# EAGLE schematic ctrl_board (EAGLE 7.6.0)
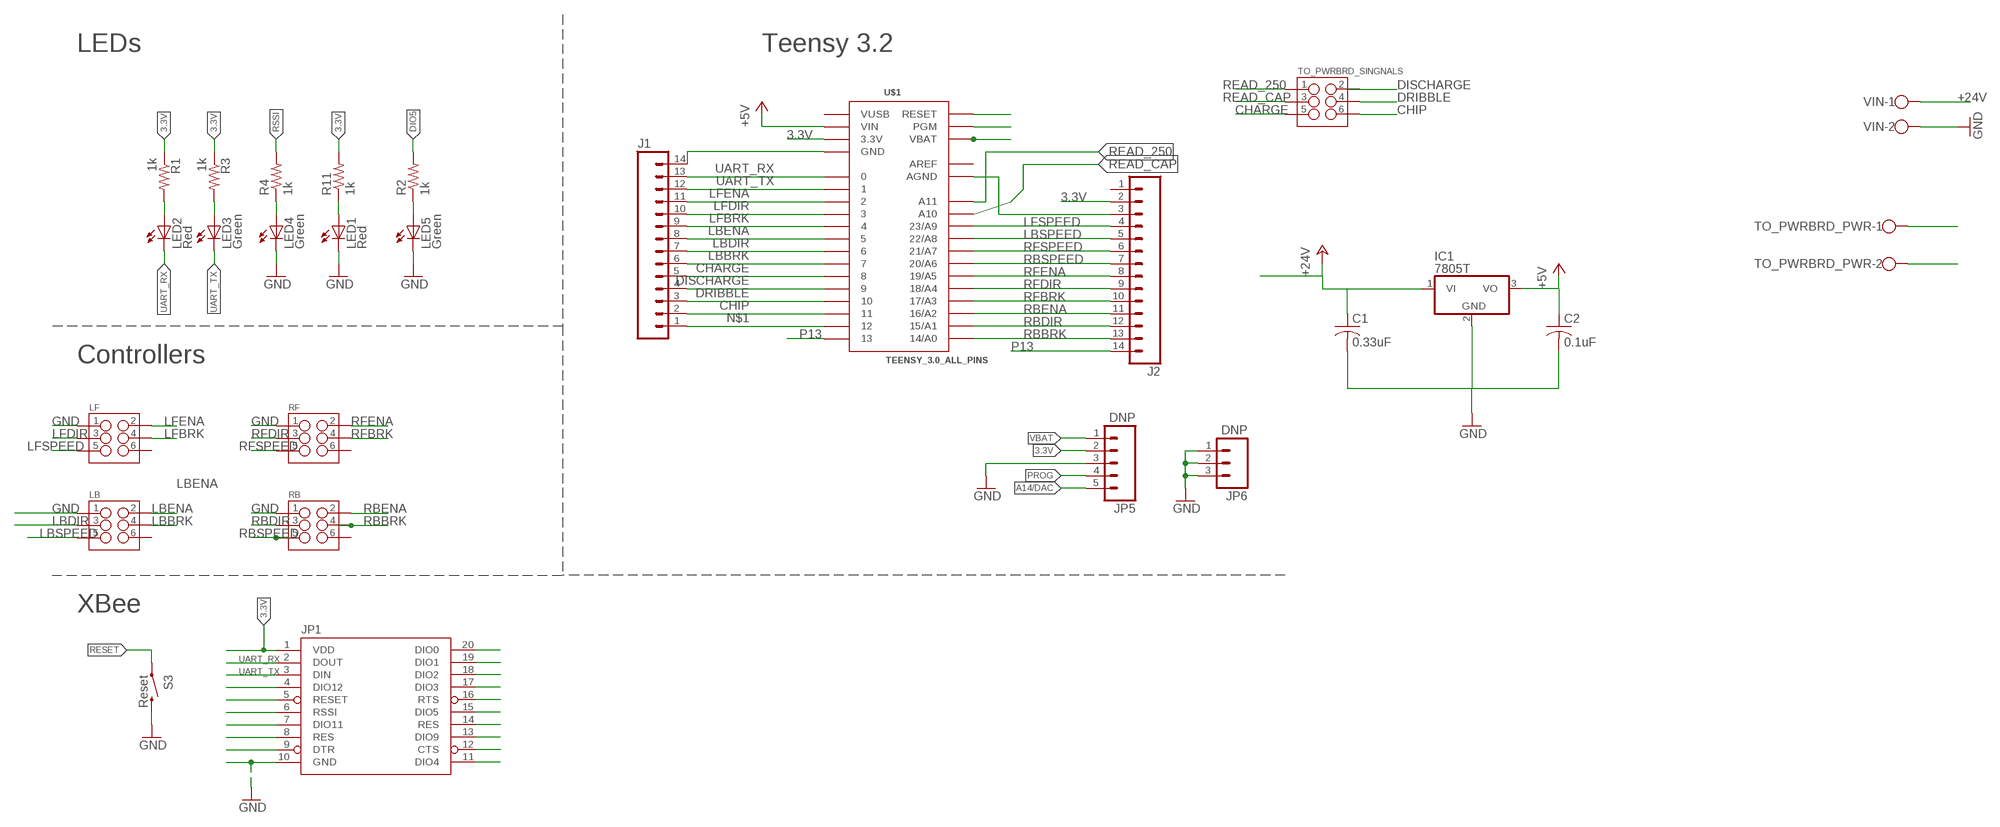
[diagram p0: schematic, sheet 1]

## Parts
C1  0.33uF  C-USC0805  [C0805]
C2  0.1uF  C-USC0805  [C0805]
IC1  7805T  [TO220H]
J1  M14  [1X14]
J2  M14  [1X14]
JP1  XBEE-1B1  [XBEE-1]
JP5  DNP  M05PTH  [1X05]
JP6  DNP  M03PTH  [1X03]
LB  M03X2POGO_PINS  [2X3_POGO]
LED1  Red  LED-RED0603  [LED-0603]
LED2  Red  LED-RED0603  [LED-0603]
LED3  Green  LED-GREEN0603  [LED-0603]
LED4  Green  LED-GREEN0603  [LED-0603]
LED5  Green  LED-GREEN0603  [LED-0603]
LF  M03X2POGO_PINS  [2X3_POGO]
R1  1k  1KOHM1/10W1%(0603)  [0603-RES]
R2  1k  1KOHM1/10W1%(0603)  [0603-RES]
R3  1k  1KOHM1/10W1%(0603)  [0603-RES]
R4  1k  1KOHM1/10W1%(0603)  [0603-RES]
R11  1k  1KOHM1/10W1%(0603)  [0603-RES]
RB  M03X2POGO_PINS  [2X3_POGO]
RF  M03X2POGO_PINS  [2X3_POGO]
S3  Reset  SWITCH-MOMENTARY-2SMD  [TACTILE-SWITCH-SMD]
TO_PWRBRD_PWR  W237-102  [W237-102]
TO_PWRBRD_SINGNALS  M03X2POGO_PINS  [2X3_POGO]
U$1  TEENSY_3.0_ALL_PINS  [TEENSY3-ALL_PINS]
VIN  W237-102  [W237-102]

## Nets
3.3V: J2.2 JP1.1(VDD) JP5.2 R1.1 R3.1 R11.2 U$1.3.3V U$1.3.3V1(3.3V)
+5V: C2.1 IC1.3(VO) U$1.VIN
+24V: C1.1 IC1.1(VI) TO_PWRBRD_PWR.1 VIN.1
A14/DAC: JP5.5 U$1.RESET/DAC(RESET)
CHARGE: J1.5 TO_PWRBRD_SINGNALS.P$5 U$1.8
CHIP: J1.2 TO_PWRBRD_SINGNALS.P$6 U$1.11
CTS: JP1.12(CTS)
DIO0: JP1.20(DIO0)
DIO1: JP1.19(DIO1)
DIO2: JP1.18(DIO2)
DIO3: JP1.17(DIO3)
DIO4: JP1.11(DIO4)
DIO5: JP1.15(DIO5) R2.2
DIO9: JP1.13(DIO9)
DIO11: JP1.7(DIO11)
DIO12: JP1.4(DIO12)
DISCHARGE: J1.4 U$1.9
DRIBBLE: J1.3 TO_PWRBRD_SINGNALS.P$4 U$1.10
DTR: JP1.9(DTR)
GND: C1.2 C2.2 IC1.2(GND) J1.14 JP1.10(GND) JP5.3 JP6.1 JP6.2 JP6.3 LB.P$1 LED1.C LED4.C LED5.C LF.P$1 RB.P$1 RF.P$1 S3.3 TO_PWRBRD_PWR.2 U$1.GND U$1.GND1(GND) VIN.2
LBBRK: J1.6 LB.P$4 U$1.7
LBDIR: J1.7 LB.P$3 U$1.6
LBENA: J1.8 LB.P$2 U$1.5
LBSPEED: J2.5 LB.P$5 U$1.22/A8
LFBRK: J1.9 LF.P$4 U$1.4
LFDIR: J1.10 LF.P$3 U$1.3
LFENA: J1.11 LF.P$2 U$1.2
LFSPEED: J2.4 LF.P$5 U$1.23/A9
N$1: J1.1 U$1.12
N$12: LED1.A R11.1
N$17: LED2.A R1.2
N$18: J2.3 U$1.AGND
N$19: LED3.A R3.2
N$43: LED4.A R4.1
N$139: LED5.A R2.1
P13: J2.14 U$1.13
PROG: JP5.4 U$1.PGM
RBBRK: J2.13 RB.P$4 U$1.14/A0
RBDIR: J2.12 RB.P$3 U$1.15/A1
RBENA: J2.11 RB.P$2 U$1.16/A2
RBSPEED: J2.7 RB.P$5 U$1.20/A6
READ_250: TO_PWRBRD_SINGNALS.P$1 U$1.A11
READ_CAP: TO_PWRBRD_SINGNALS.P$3 U$1.A10
RES: JP1.8(RES)
RES2: JP1.14(RES)
RESET: JP1.5(RESET) S3.1
RFBRK: J2.10 RF.P$4 U$1.17/A3
RFDIR: J2.9 RF.P$3 U$1.18/A4
RFENA: J2.8 RF.P$2 U$1.19/A5
RFSPEED: J2.6 RF.P$5 U$1.21/A7
RSSI: JP1.6(RSSI) R4.2
RTS: JP1.16(RTS)
UART_RX: J1.13 JP1.2(DOUT) LED2.C U$1.0
UART_TX: J1.12 JP1.3(DIN) LED3.C U$1.1
VBAT: JP5.1 U$1.VBAT
Unconnected: J2.1 LB.P$6 LF.P$6 RB.P$6 RF.P$6 TO_PWRBRD_SINGNALS.P$2

## Notes on the sheet
- LEDs | Teensy 3.2
- Controllers
- XBee

## Power pins joined to a net without a drawn wire
AREF: U$1.AREF
VUSB: U$1.VUSB

## Library data of the parts
C1 C2 = adafruit:C-US: CAPACITOR, American symbol
IC1 = linear:78*: Positive VOLTAGE REGULATOR Source: http://cache.national.com/ds/LM/LM78L05.pdf http://www.fairchildsemi.com/ds/LM/LM7805.pdf
J1 J2 = SparkFun-Connectors:M14: Header 14 Standard 14-pin 0.1" header. Use with straight break away headers (SKU : PRT-00116), right angle break away headers (PRT-00553), swiss pins (PRT-00743), machine pins (PRT-00117), and female headers (PRT-00115).
JP1 = SparkFun-RF:XBEE-1: Xbee module footprints
JP5 = SparkFun-Connectors:M05: Header 5 Standard 5-pin 0.1" header. Use with straight break away headers (SKU : PRT-00116), right angle break away headers (PRT-00553), swiss pins (PRT-00743), machine pins (PRT-00117), and female headers (PRT-00115). Molex polarized connector foot print use with SKU : PRT-08230 with associated crimp pins and housings.
JP6 = SparkFun-Connectors:M03: Header 3 Standard 3-pin 0.1" header. Use with straight break away headers (SKU : PRT-00116), right angle break away headers (PRT-00553), swiss pins (PRT-00743), machine pins (PRT-00117), and female headers (PRT-00115). Molex polarized connector foot print use with SKU : PRT-08232 with associated crimp pins and housings.
LB LF RB RF TO_PWRBRD_SINGNALS = SparkFun-Connectors:M03X2: 2x3 .1" header. Shrouded, with keying- CONN-10681 SMT- CONN-11415 Pogo pins- HW-11044; PROD_ID: HW-11044
LED1 LED2 = SparkFun-LED:LED-RED: Assorted Red LEDs LilyPad 1206- DIO-09912 1206- DIO-00809 0603- DIO-00819; PROD_ID: DIO-00819; VALUE: RED
LED3-LED5 = SparkFun-LED:LED-GREEN: Various green LEDs Green LEDs used in SFE Production 0603- DIO-00821 LARGE- DIO-00862 LILYPAD- DIO-09910; PROD_ID: DIO-00821; VALUE: GREEN
R1-R4 R11 = SparkFun-Resistors:1KOHM1/10W1%(0603): RES-07856; PROD_ID: RES-07856; VALUE: 1K
S3 = SparkFun-Electromechanical:SWITCH-MOMENTARY-2: Various NO switches- pushbuttons, reed, etc; PROD_ID: SWCH-08247
TO_PWRBRD_PWR VIN = con-wago-500:W237-102: WAGO SCREW CLAMP; MPN: 237-102; OC_FARNELL: unknown; OC_NEWARK: 70K9898
U$1 = Teensy_3_and_LC_Series_Boards_v1.1:TEENSY_3.0_ALL_PINS: Teensy 3.0 board, showing all pins that are easily acessible. See 'AllAnalogPins" and 'AllPins' packages for additional pin holes, as needed. The 'Basic' package has fewer pins.

## Net classes
0 default: width 0.203 mm
1 vcc: width 0.254 mm